# Altium schematic sheet USB.SchDoc
size 420 x 297 mm; SheetNumber: 12; SheetTotal: 19
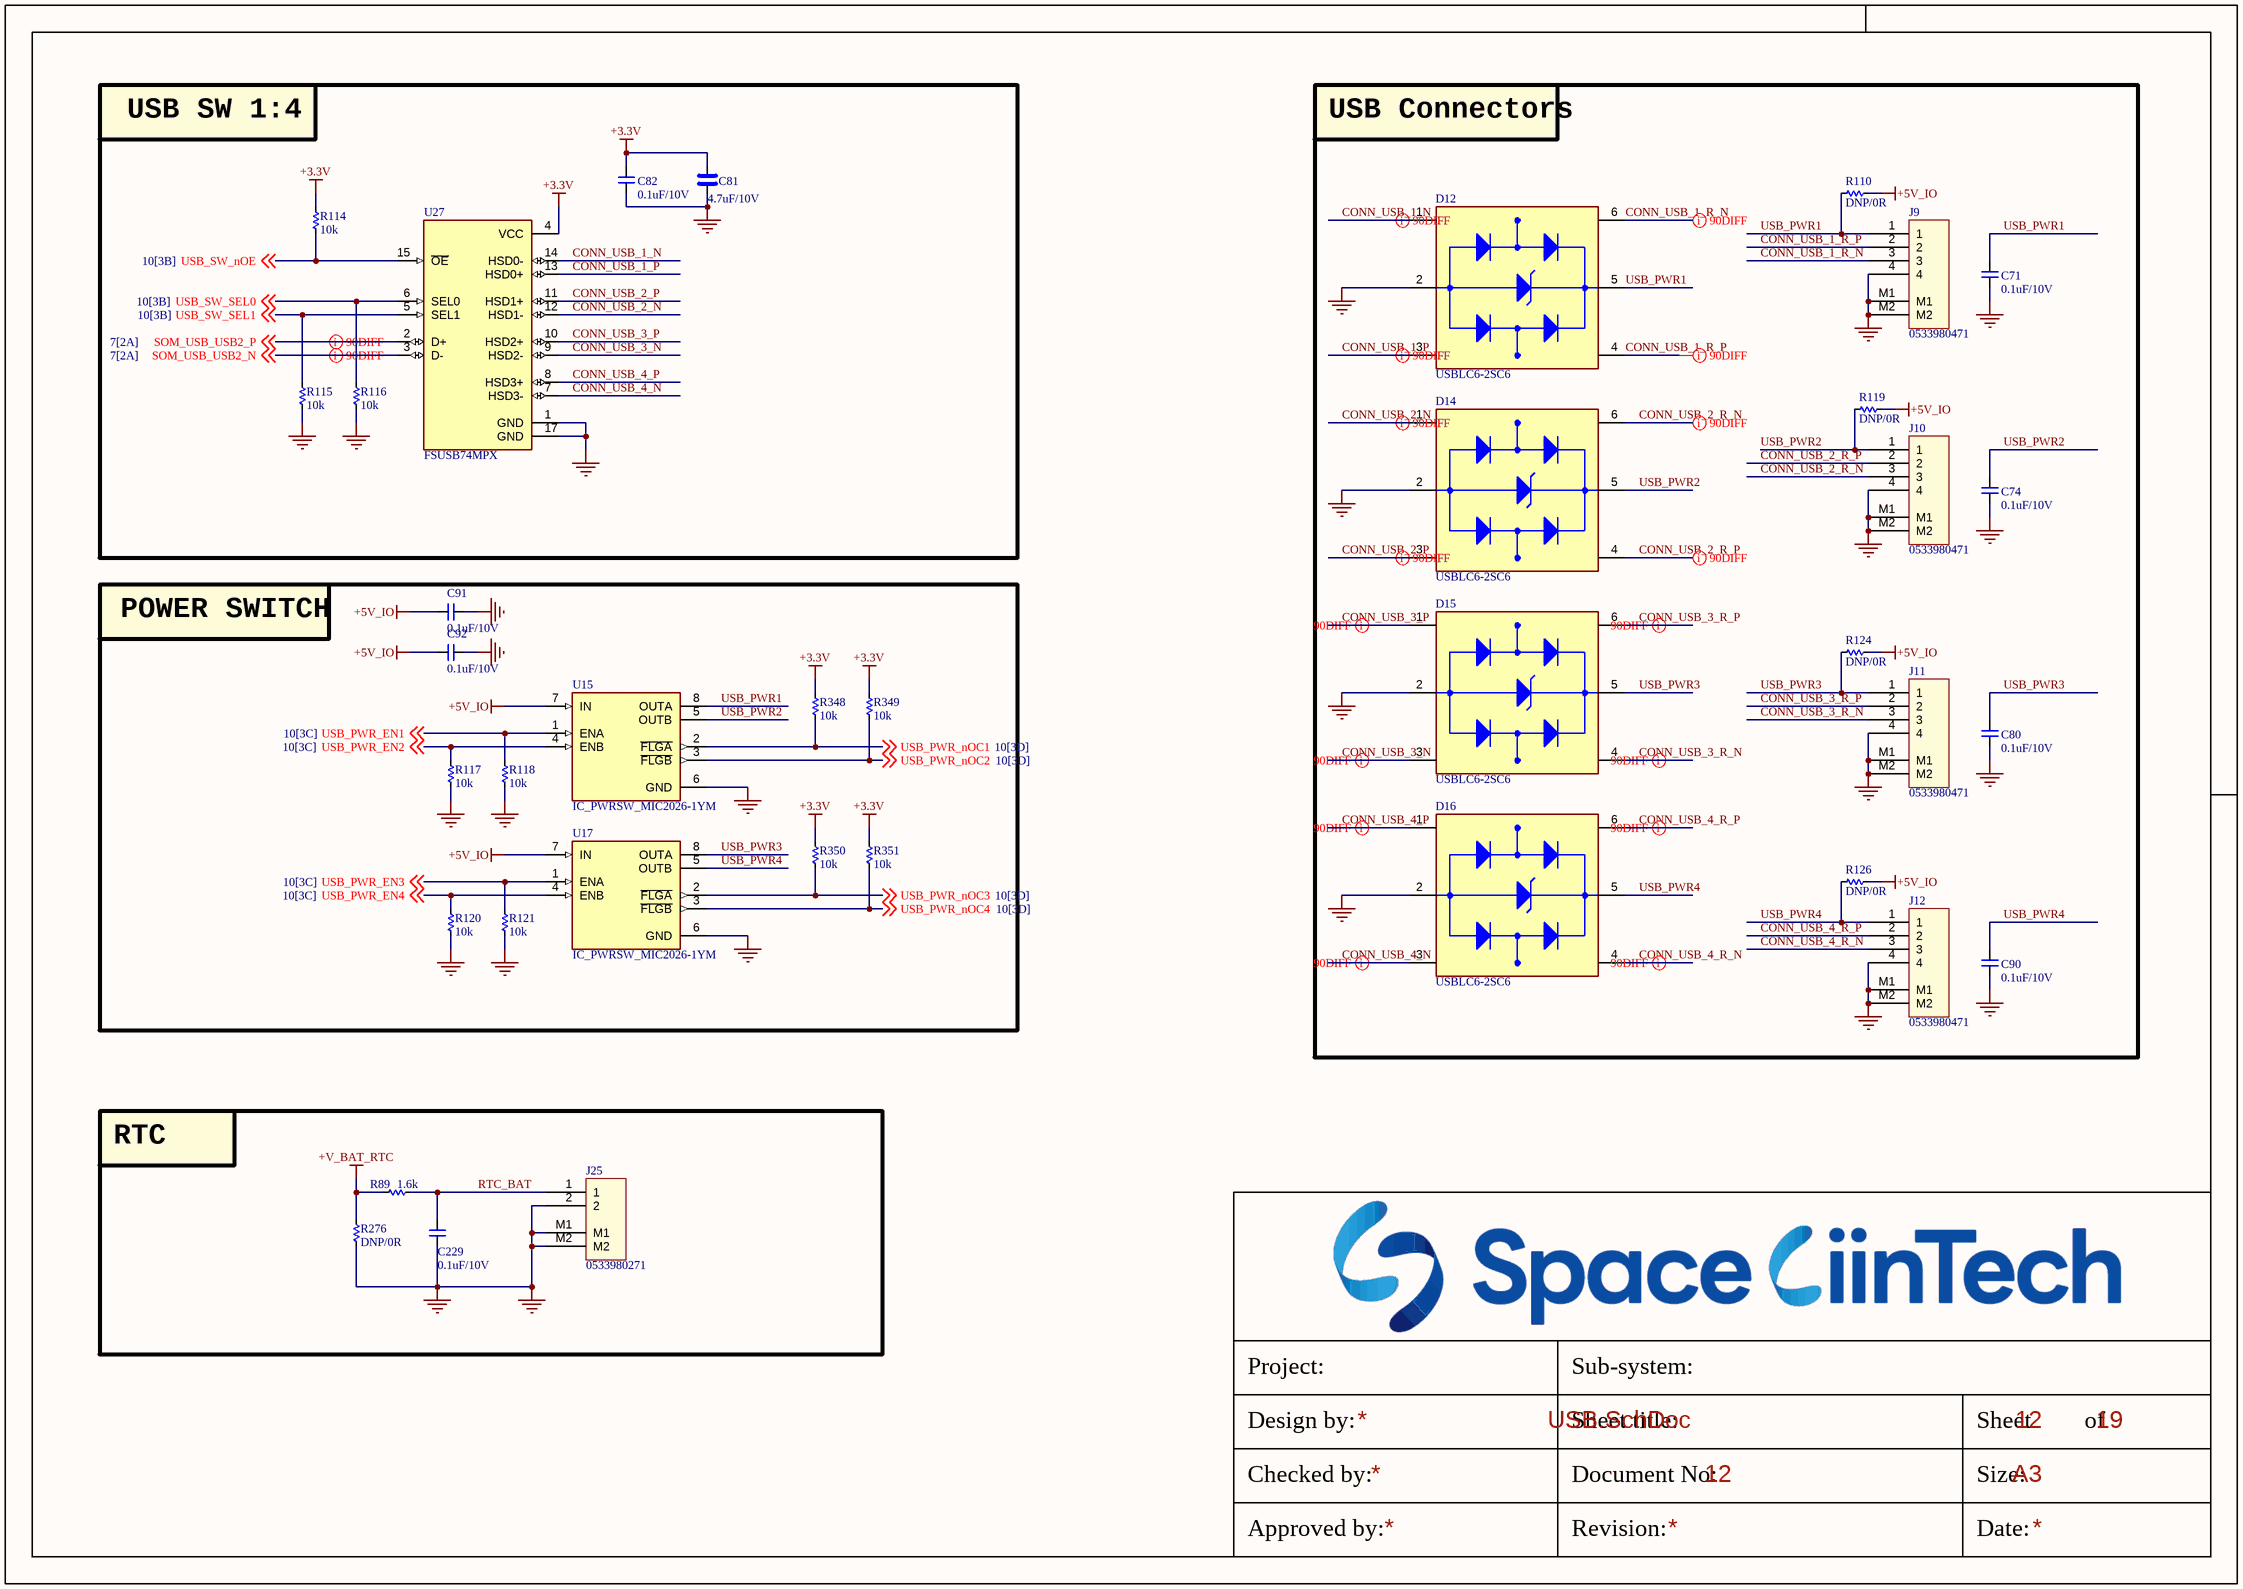
[diagram p0: USB.SchDoc]

## Parts
C71  0.1uF/10V  [CAP_C_1005X60]
C74  0.1uF/10V  [CAP_C_1005X60]
C80  0.1uF/10V  [CAP_C_1005X60]
C81  4.7uF/10V  [CAP_C_1608X80]
C82  0.1uF/10V  [CAP_C_1005X60]
C90  0.1uF/10V  [CAP_C_1005X60]
C91  0.1uF/10V  [CAP_C_1005X60]
C92  0.1uF/10V  [CAP_C_1005X60]
C229  0.1uF/10V  [CAP_C_1005X60]
D12  USBLC6-2SC6  [SOT95P280X145-6N]
D14  USBLC6-2SC6  [SOT95P280X145-6N]
D15  USBLC6-2SC6  [SOT95P280X145-6N]
D16  USBLC6-2SC6  [SOT95P280X145-6N]
J9  0533980471  [MOLEX_0533980471]
J10  0533980471  [MOLEX_0533980471]
J11  0533980471  [MOLEX_0533980471]
J12  0533980471  [MOLEX_0533980471]
J25  0533980271  [MOLEX_0533980271]
R89  1.6k  [RES_C_1005X40]
R110  DNP/0R  [RES_C_1005X40]
R114  10k  [RES_C_1005X40]
R115  10k  [RES_C_1005X40]
R116  10k  [RES_C_1005X40]
R117  10k  [RES_C_1005X40]
R118  10k  [RES_C_1005X40]
R119  DNP/0R  [RES_C_1005X40]
R120  10k  [RES_C_1005X40]
R121  10k  [RES_C_1005X40]
R124  DNP/0R  [RES_C_1005X40]
R126  DNP/0R  [RES_C_1005X40]
R276  DNP/0R  [RES_C_1005X40]
R348  10k  [RES_C_1005X40]
R349  10k  [RES_C_1005X40]
R350  10k  [RES_C_1005X40]
R351  10k  [RES_C_1005X40]
U15  IC_PWRSW_MIC2026-1YM  [SOIC127P602X173-8N]
U17  IC_PWRSW_MIC2026-1YM  [SOIC127P602X173-8N]
U27  FSUSB74MPX  [QFN50P300X300X80-17N]

## Blocks framed on the sheet
USB SW 1:4: C81 C82 R114-R116 U27
USB Connectors: C71 C74 C80 C90 D12 D14-D16 J9-J12 R110 R119 R124 R126
POWER SWITCH: C91 C92 R117 R118 R120 R121 R348-R351 U15 U17
RTC: C229 J25 R89 R276

## Nets
+3.3V: C81.2 C82.2 R114.1 R348.1 R349.1 R350.1 R351.1 U27.4(VCC)
+5V_IO: C91.2 C92.2 R110.1 R119.1 R124.1 R126.1 U15.7(IN) U17.7(IN)
+V_BAT_RTC: R89.1 R276.1
GND: C71.1 C74.1 C80.1 C81.1 C82.1 C90.1 C91.1 C92.1 C229.1 D12.2(GND) D14.2(GND) D15.2(GND) D16.2(GND) J9.4 J9.M1 J9.M2 J10.4 J10.M1 J10.M2 J11.4 J11.M1 J11.M2 J12.4 J12.M1 J12.M2 J25.2 J25.M1 J25.M2 R115.2 R116.2 R117.2 R118.2 R120.2 R121.2 R276.2 U15.6(GND) U17.6(GND) U27.1(GND) U27.17(GND)
CONN_USB_1_N: D12.1(I/O1_IN) U27.14(HSD0-)
CONN_USB_1_P: D12.3(I/O2_IN) U27.13(HSD0+)
CONN_USB_1_R_N: D12.6(I/O1_OUT) J9.3
CONN_USB_1_R_P: D12.4(I/O2_OUT) J9.2
CONN_USB_2_N: D14.1(I/O1_IN) U27.12(HSD1-)
CONN_USB_2_P: D14.3(I/O2_IN) U27.11(HSD1+)
CONN_USB_2_R_N: D14.6(I/O1_OUT) J10.3
CONN_USB_2_R_P: D14.4(I/O2_OUT) J10.2
CONN_USB_3_N: D15.3(I/O2_IN) U27.9(HSD2-)
CONN_USB_3_P: D15.1(I/O1_IN) U27.10(HSD2+)
CONN_USB_3_R_N: D15.4(I/O2_OUT) J11.3
CONN_USB_3_R_P: D15.6(I/O1_OUT) J11.2
CONN_USB_4_N: D16.3(I/O2_IN) U27.7(HSD3-)
CONN_USB_4_P: D16.1(I/O1_IN) U27.8(HSD3+)
CONN_USB_4_R_N: D16.4(I/O2_OUT) J12.3
CONN_USB_4_R_P: D16.6(I/O1_OUT) J12.2
RTC_BAT: C229.2 J25.1 R89.2
SOM_USB_USB2_N: U27.3(D-) ; off-sheet SOM_USB_USB2_N
SOM_USB_USB2_P: U27.2(D+) ; off-sheet SOM_USB_USB2_P
USB_PWR1: C71.2 D12.5(VBUS) J9.1 R110.2 U15.8(OUTA)
USB_PWR2: C74.2 D14.5(VBUS) J10.1 R119.2 U15.5(OUTB)
USB_PWR3: C80.2 D15.5(VBUS) J11.1 R124.2 U17.8(OUTA)
USB_PWR4: C90.2 D16.5(VBUS) J12.1 R126.2 U17.5(OUTB)
USB_PWR_EN1: R118.1 U15.1(ENA) ; off-sheet USB_PWR_EN1
USB_PWR_EN2: R117.1 U15.4(ENB) ; off-sheet USB_PWR_EN2
USB_PWR_EN3: R121.1 U17.1(ENA) ; off-sheet USB_PWR_EN3
USB_PWR_EN4: R120.1 U17.4(ENB) ; off-sheet USB_PWR_EN4
USB_PWR_nOC1: R348.2 U15.2(~{FLGA}) ; off-sheet USB_PWR_nOC1
USB_PWR_nOC2: R349.2 U15.3(~{FLGB}) ; off-sheet USB_PWR_nOC2
USB_PWR_nOC3: R350.2 U17.2(~{FLGA}) ; off-sheet USB_PWR_nOC3
USB_PWR_nOC4: R351.2 U17.3(~{FLGB}) ; off-sheet USB_PWR_nOC4
USB_SW_nOE: R114.2 U27.15(~{OE}) ; off-sheet USB_SW_nOE
USB_SW_SEL0: R116.1 U27.6(SEL0) ; off-sheet USB_SW_SEL0
USB_SW_SEL1: R115.1 U27.5(SEL1) ; off-sheet USB_SW_SEL1

## Layout directives
differential pair; differential pair class DIFF90: CONN_USB_1_N, CONN_USB_1_P, CONN_USB_1_R_N, CONN_USB_1_R_P, CONN_USB_2_N, CONN_USB_2_P, CONN_USB_2_R_N, CONN_USB_2_R_P, CONN_USB_3_N, CONN_USB_3_P, CONN_USB_3_R_N, CONN_USB_3_R_P, CONN_USB_4_N, CONN_USB_4_P, CONN_USB_4_R_N, CONN_USB_4_R_P, SOM_USB_USB2_N, SOM_USB_USB2_P

## Notes on the sheet
- Project:
- Sub-system:
- Design by:
- Sheet title:
- Sheet
- of
- Checked by:
- Approved by:
- Revision:
- Document No:
- Size:
- Date:
- A3

## Library data of the parts
C71 C74 C80 C82 C90-C92 C229 = _CAP_C_2: CAP CHIP
C81 = _CAP_C_High_2: CAP CHIP High Value
D12 D14-D16 = USBLC6-2SC6: 17V Clamp 5A (8/20Âµs) Ipp Tvs Diode Surface Mount SOT-23-6; MF: STMicroelectronics; Value: *; SnapEDA_Link: https://www.snapeda.com/parts/USBLC6-2SC6/STMicroelectronics/view-part/?ref=snap; Check_prices: https://www.snapeda.com/parts/USBLC6-2SC6/STMicroelectronics/view-part/?ref=eda; Purchase-URL: https://pricing.snapeda.com/search/part/USBLC6-2SC6/?ref=eda; Price: None; Availability: In Stock; Package: SOT-23-6 STMicroelectronics; MP: USBLC6-2SC6
J9-J12 = Header 4x1_2M
J25 = Header 2x1_2M
R89 R110 R114-R121 R124 R126 R276 R348-R351 = _RES_B_2: RES
U15 U17 = IC_PWRSW_MIC2026-1YM: Power Switch/Driver 1:2 N-Channel 1.25A 8-SOIC; MF: Microchip; SnapEDA_Link: https://www.snapeda.com/parts/MIC2026-1YM/Microchip/view-part/?ref=snap; Package: SO-8 Microchip; Value: *; MP: MIC2026-1YM; Check_prices: https://www.snapeda.com/parts/MIC2026-1YM/Microchip/view-part/?ref=eda
U27 = IC_USB_SW_FSUSB74MPX: USB Switch IC 1 Channel 16-MLP (3x3); MF: ON Semiconductor; SnapEDA_Link: https://www.snapeda.com/parts/FSUSB74MPX/Onsemi/view-part/?ref=snap; Package: WQFN-16 ON Semiconductor; Value: *; MP: FSUSB74MPX; Check_prices: https://www.snapeda.com/parts/FSUSB74MPX/Onsemi/view-part/?ref=eda